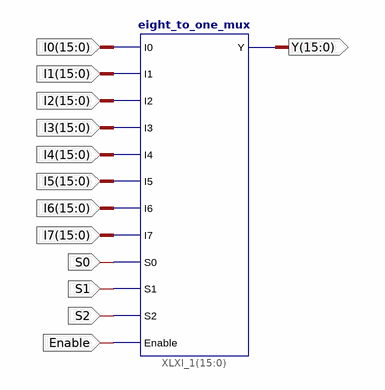
[diagram p0: schematic sheet 1]
// Xilinx ISE schematic eight_to_one_mux_16bit.sch (spartan6) as structural Verilog: 1 symbols, 13 ports
module eight_to_one_mux_16bit (
  input  [15:0] I0,
  input  [15:0] I1,
  input  [15:0] I2,
  input  [15:0] I3,
  input  [15:0] I4,
  input  [15:0] I5,
  input  [15:0] I6,
  input  [15:0] I7,
  input  Enable,
  input  S2,
  input  S1,
  input  S0,
  output [15:0] Y
);

  eight_to_one_mux XLXI_1[15:0] (
    .Enable(Enable), .I0(I0), .I1(I1), .I2(I2), .I3(I3), .I4(I4), .I5(I5), .I6(I6), .I7(I7), .S0(S0),
    .S1(S1), .S2(S2), .Y(Y));
endmodule
